# EAGLE schematic LARSON-MH (EAGLE 9.6.2)
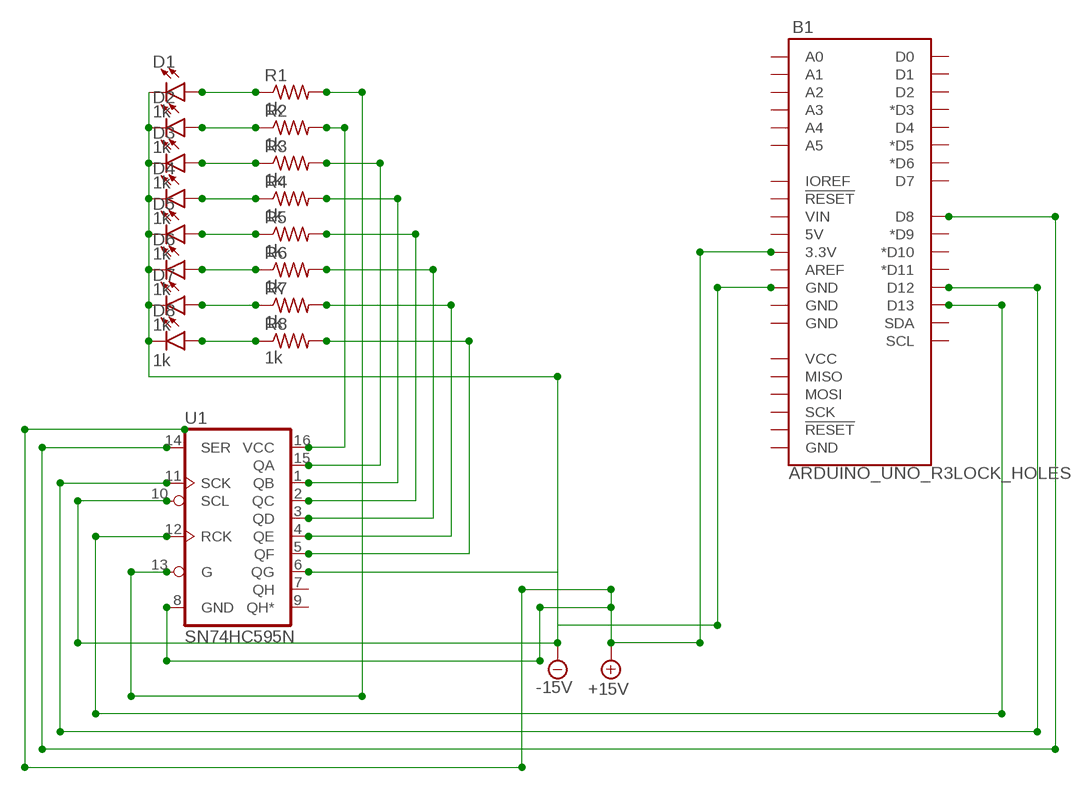
[diagram p0: schematic, sheet 1]

## Parts
B1  ARDUINO_UNO_R3LOCK_HOLES  [ARDUINO_R3_LOCK_HOLES]
D1  1k  LED5MM  [LED_5MM]
D2  1k  LED5MM  [LED_5MM]
D3  1k  LED5MM  [LED_5MM]
D4  1k  LED5MM  [LED_5MM]
D5  1k  LED5MM  [LED_5MM]
D6  1k  LED5MM  [LED_5MM]
D7  1k  LED5MM  [LED_5MM]
D8  1k  LED5MM  [LED_5MM]
R1  1k  R-US_R0603  [R0603]
R2  1k  R-US_R0603  [R0603]
R3  1k  R-US_R0603  [R0603]
R4  1k  R-US_R0603  [R0603]
R5  1k  R-US_R0603  [R0603]
R6  1k  R-US_R0603  [R0603]
R7  1k  R-US_R0603  [R0603]
R8  1k  R-US_R0603  [R0603]
U1  SN74HC595N  74HC595N  [DIP16]

## Nets
+15V: B1.3.3V U1.8(GND)
-15V: B1.GND@4(GND) D1.K(C) D2.K(C) D3.K(C) D4.K(C) D5.K(C) D6.K(C) D7.K(C) D8.K(C) U1.6(QG) U1.10(SCL)
N$1: B1.D13 U1.12(RCK)
N$2: R3.2 U1.15(QA)
N$3: D1.A R1.1
N$4: D2.A R2.1
N$5: D3.A R3.1
N$6: D4.A R4.1
N$7: D5.A R5.1
N$8: D6.A R6.1
N$9: D7.A R7.1
N$10: D8.A R8.1
N$11: R1.2 U1.13(G)
N$12: R4.2 U1.1(QB)
N$13: B1.D12 U1.11(SCK)
N$14: B1.D8 U1.14(SER)
N$15: R5.2 U1.2(QC)
N$16: R2.2 U1.16(VCC)
N$17: R6.2 U1.3(QD)
N$18: R7.2 U1.4(QE)
N$19: R8.2 U1.5(QF)
Unconnected: B1.5V B1.A0 B1.A1 B1.A2 B1.A3 B1.A4 B1.A5 B1.AREF B1.D0 B1.D1 B1.D2 B1.D3(*D3) B1.D4 B1.D5(*D5) B1.D6(*D6) B1.D7 B1.D9(*D9) B1.D10(*D10) B1.D11(*D11) B1.GND@1(GND) B1.GND@2(GND) B1.GND@3(GND) B1.IOREF B1.MISO B1.MOSI B1.RESET@1(!RESET!) B1.RESET@2(!RESET!) B1.SCK B1.SCL B1.SDA B1.VCC B1.VIN U1.7(QH) U1.9(QH*)

## Library data of the parts
B1 = SparkFun-Boards:ARDUINO_UNO_R3: Arduino R3 Footprint with SPI header Arduino Uno R3 Compatible Footprint. Matches PCB size of the original board. SparkFun Products: SAMD21 Dev Breakout <https://www.sparkfun.com/products/13672> RedBoard <https://www.sparkfun.com/products/12757> R3 Stackable Headers <https://www.sparkfun.com/products/11417>
D1-D8 = SparkFun-LED:LED: LED (Generic) Standard schematic elements and footprints for 5mm, 3mm, 1206, and 0603 sized LEDs. Generic LEDs with no color specified.
R1-R8 = rcl:R-US_: RESISTOR, American symbol; SPICEPREFIX: R
U1 = SparkFun-IC-Logic:74*595: 8-Bit Shift Register (Serial to Parallel) Datasheet <http://cdn.sparkfun.com/datasheets/BreakoutBoards/MM74HC595.pdf> SparkFun Products SparkFun Shift Register Breakout - 74HC595 <https://www.sparkfun.com/products/10680> (BOB-10680); PROD_ID: IC-13123